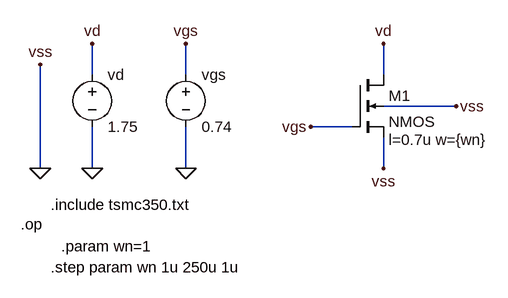
[diagram p0: schematic CS_amplifier.asc]
CS_amplifier.asc, the LTspice schematic file:
Version 4
SHEET 1 880 680
WIRE -128 128 -128 80
WIRE 16 128 16 80
WIRE 320 128 320 80
WIRE 432 176 320 176
WIRE 272 208 208 208
WIRE -208 272 -208 112
WIRE -128 272 -128 208
WIRE 16 272 16 208
WIRE 320 272 320 224
FLAG 16 272 0
FLAG -128 272 0
FLAG -208 272 0
FLAG -208 112 vss
FLAG -128 80 vd
FLAG 16 80 vgs
FLAG 320 272 vss
FLAG 432 176 vss
FLAG 208 208 vgs
FLAG 320 80 vd
SYMBOL nmos4 272 128 R0
WINDOW 123 56 100 Left 2
SYMATTR InstName M1
SYMATTR Value2 l=0.7u w={wn}
SYMBOL voltage 16 112 R0
WINDOW 123 0 0 Left 0
WINDOW 39 0 0 Left 0
SYMATTR InstName vgs
SYMATTR Value 0.74
SYMBOL voltage -128 112 R0
WINDOW 123 0 0 Left 0
WINDOW 39 0 0 Left 0
SYMATTR InstName vd
SYMATTR Value 1.75
TEXT -192 328 Left 2 !.include tsmc350.txt
TEXT -238 358 Left 2 !.op
TEXT -176 392 Left 2 !.param wn=1
TEXT -192 424 Left 2 !.step param wn 1u 250u 1u

The netlist it stands for:
* CS_amplifier.asc
M1 vd vgs 0 0 NMOS l=0.7u w={wn}
vgs vgs 0 0.74
vd vd 0 1.75
.model NMOS NMOS
.model PMOS PMOS
.lib standard.mos
.include tsmc350.txt
.op
.param wn=1
.step param wn 1u 250u 1u
.backanno
.end